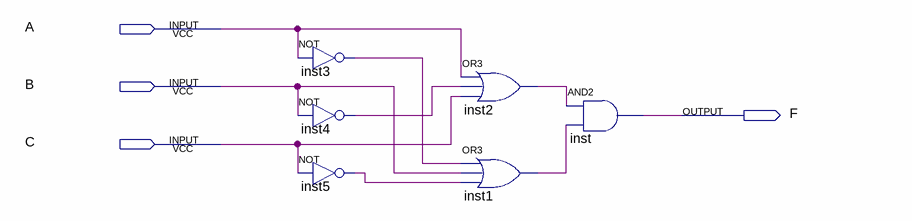
[diagram p0: schematic sheet]
// Quartus schematic lab3step0.bdf as structural Verilog: 6 symbols, 4 pins
module lab3step0 (
  input  A,
  input  B,
  input  C,
  output F
);

  wire inst1_out, inst2_out, inst3_out, inst4_out, inst5_out;

  not inst3 (inst3_out, A);
  not inst4 (inst4_out, B);
  not inst5 (inst5_out, C);
  or inst2 (inst2_out, A, inst4_out, C);
  or inst1 (inst1_out, inst3_out, B, inst5_out);
  and inst (F, inst2_out, inst1_out);
endmodule
